# Altium schematic sheet SKF.SchDoc
size A
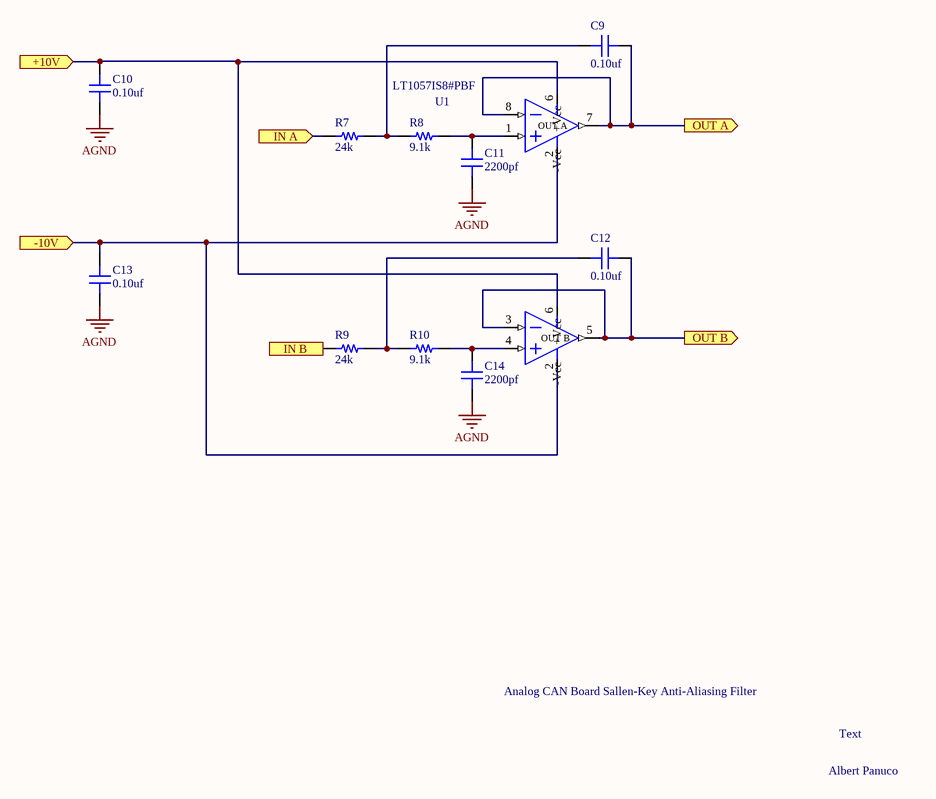
[diagram p0: SKF.SchDoc]

## Parts
C9  value 0.10uf  [CAP 0805/2012]  (hidden comment: Capacitor MLCC 0.10uf 25V CAP 0805/2012)
C10  value 0.10uf  [CAP 0805/2012]  (hidden comment: Capacitor MLCC 0.10uf 25V CAP 0805/2012)
C11  value 2200pf  [CAP 0805/2012]  (hidden comment: Capacitor MLCC 2200pf 25V CAP 0805/2012)
C12  value 0.10uf  [CAP 0805/2012]  (hidden comment: Capacitor MLCC 0.10uf 25V CAP 0805/2012)
C13  value 0.10uf  [CAP 0805/2012]  (hidden comment: Capacitor MLCC 0.10uf 25V CAP 0805/2012)
C14  value 2200pf  [CAP 0805/2012]  (hidden comment: Capacitor MLCC 2200pf 25V CAP 0805/2012)
R7  value 24k  [RES 0805/2012]  (hidden comment: Resistor 24k 0805 1/10W 1%)
R8  value 9.1k  [RES 0805/2012]  (hidden comment: Resistor 9.1k 0805 1/10W 1%)
R9  value 24k  [RES 0805/2012]  (hidden comment: Resistor 24k 0805 1/10W 1%)
R10  value 9.1k  [RES 0805/2012]  (hidden comment: Resistor 9.1k 0805 1/10W 1%)
U1  LT1057IS8#PBF  [SOIC-8]

## Ports
+10V (in), -10V (in), IN A (in), IN B (in), OUT A (out), OUT B (out)

## Nets
AGND: C10.1 C11.1 C13.2 C14.1
+10V: C10.2 U1.6(+Vcc) ; port +10V
-10V: C13.1 U1.2(-Vcc) ; port -10V
IN A: R7.1 ; port IN A
IN B: R9.1 ; port IN B
OUT A: C9.2 U1.7(OUT_A) U1.8(-IN_A) ; port OUT A
OUT B: C12.2 U1.3(+IN_B) U1.5(OUT_B) ; port OUT B
NetC9_1: C9.1 R7.2 R8.1
NetC11_2: C11.2 R8.2 U1.1(+IN_A)
NetC12_1: C12.1 R9.2 R10.1
NetC14_2: C14.2 R10.2 U1.4(+IN_B)

## Notes on the sheet
- Analog CAN Board Sallen-Key Anti-Aliasing Filter
- Text
- Albert Panuco

## Library data of the parts
C9 C10 C12 C13 = 703: Manufacturer_id: 1; idCapacitor: 703; Name: Cap_0.10uf_25V_CAP 0805/2012; Dielectric: Ceramic; Created_By: Nick Mah; Drawer_id: 1; Voltage_Rating: 25V; Package: CAP 0805/2012; Created_Date: 10/20/2018
C11 C14 = 681: Manufacturer_id: 1; idCapacitor: 681; Name: Cap_2200pf_25V_CAP 0805/2012; Dielectric: Ceramic; Created_By: Nick Mah; Drawer_id: 1; Voltage_Rating: 25V; Package: CAP 0805/2012; Created_Date: 10/20/2018
R7 R9 = 538: Manufacturer_id: 1; idResistor: 538; Name: Res_24k_0805_1/10W_1%; Created_By: Nick Mah; Supplier 1: Digi-Key; Drawer_id: 1; Tolerance: 1%; Power: 1/10W; Package: 0805; ComponentLink1Description: Datasheet; Created_Date: 2018-10-20
R8 R10 = 528: Manufacturer_id: 1; idResistor: 528; Name: Res_9.1k_0805_1/10W_1%; Created_By: Nick Mah; Supplier 1: Digi-Key; Drawer_id: 1; Tolerance: 1%; Power: 1/10W; Package: 0805; ComponentLink1Description: Datasheet; Created_Date: 2018-10-20
U1 = 1: IC OPAMP JFET 5MHZ 8SO; idOp_Amp: 1; Num_Circuits: 2; Slew_Rate: 13 V/us; Supply_Voltage: 10~18; Created_By: Albert Panuco; Manufacturer_id: 1; Drawer_id: 1; Name: OPAMP JFET; Amplifier_Type: JFET; GBW: 5MHz; Package: 8-SO; MfrPartNo: LT1057IS8#PBF; Link: https://www.digikey.com/product-detail/en/linear-technology-analog-devices/LT1057IS8-PBF/LT1057IS8-PBF-ND/961410; Supplier1: Digikey; Supplier1PartNo: LT1057IS8#PBF-ND